# Altium schematic sheet Sheet1.SchDoc
size A3; SheetNumber: 1; SheetTotal: 1
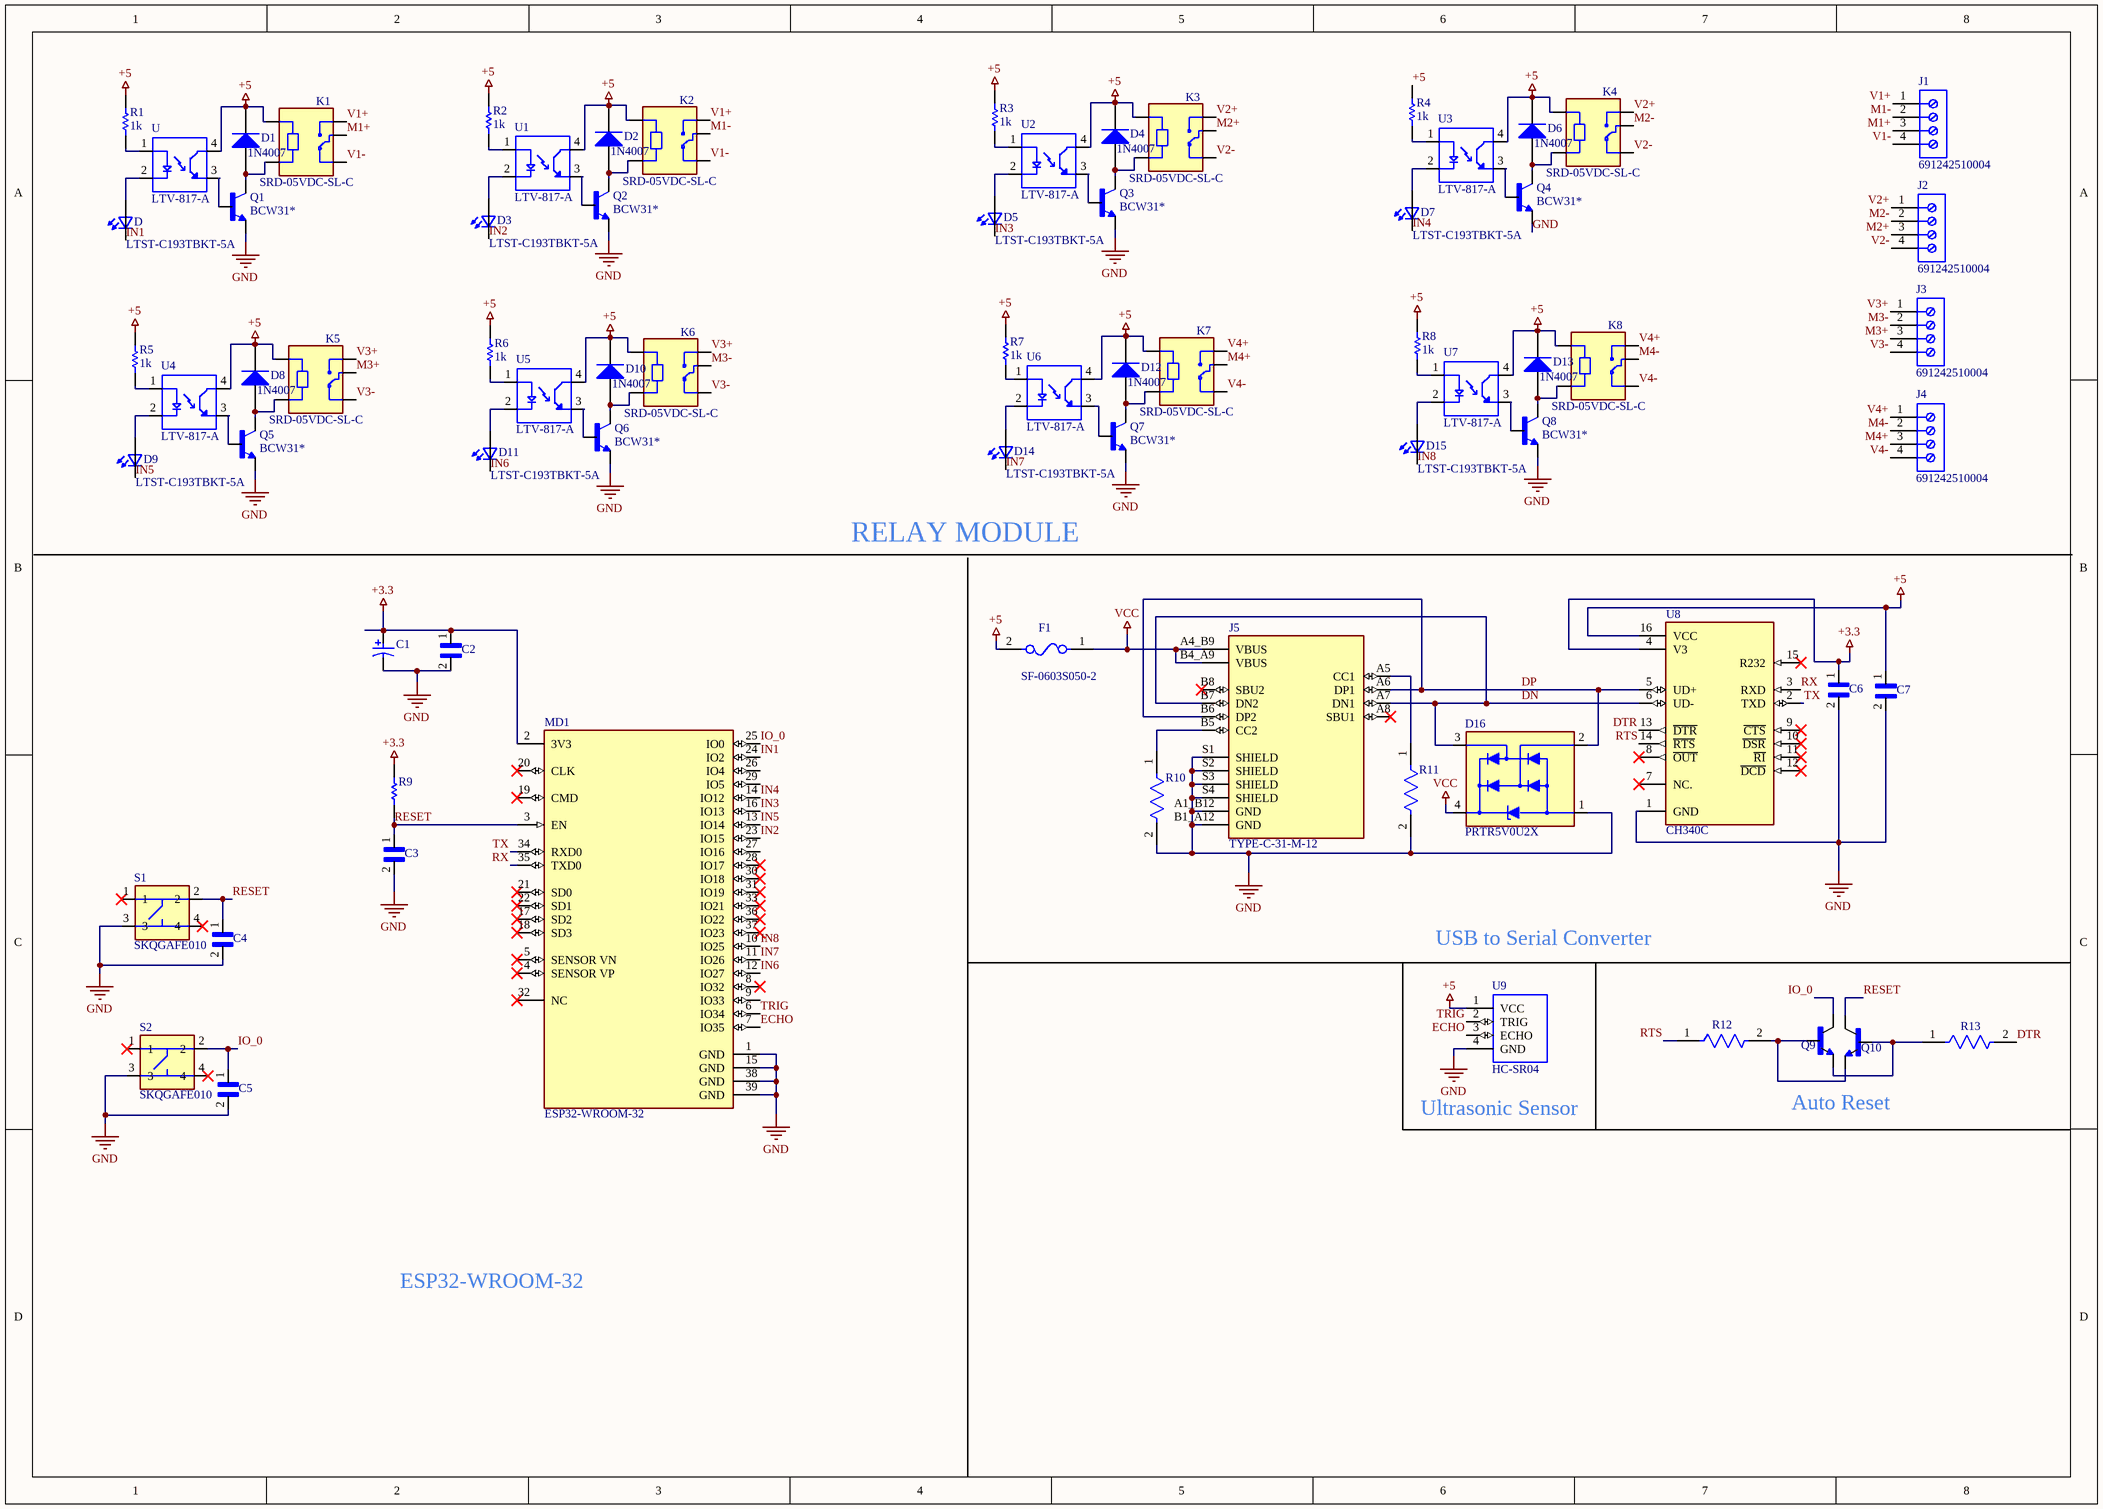
[diagram p0: Sheet1.SchDoc]

## Parts
C1  T491B226K010AT  [KEMT-T491-B_L]  (value not drawn)
C2  GRM31MR71H104KA01L  [CAPC3216X125N]  (value not drawn)
C3  GRM31MR71H104KA01L  [CAPC3216X125N]  (value not drawn)
C4  GRM31MR71H104KA01L  [CAPC3216X125N]  (value not drawn)
C5  GRM31MR71H104KA01L  [CAPC3216X125N]  (value not drawn)
C6  GRM31MR71H104KA01L  [CAPC3216X125N]  (value not drawn)
C7  GRM31MR71H104KA01L  [CAPC3216X125N]  (value not drawn)
D  LTST-C193TBKT-5A  [0603]
D1  1N4007  [FAIR-DO-41-2]
D2  1N4007  [FAIR-DO-41-2]
D3  LTST-C193TBKT-5A  [0603]
D4  1N4007  [FAIR-DO-41-2]
D5  LTST-C193TBKT-5A  [0603]
D6  1N4007  [FAIR-DO-41-2]
D7  LTST-C193TBKT-5A  [0603]
D8  1N4007  [FAIR-DO-41-2]
D9  LTST-C193TBKT-5A  [0603]
D10  1N4007  [FAIR-DO-41-2]
D11  LTST-C193TBKT-5A  [0603]
D12  1N4007  [FAIR-DO-41-2]
D13  1N4007  [FAIR-DO-41-2]
D14  LTST-C193TBKT-5A  [0603]
D15  LTST-C193TBKT-5A  [0603]
D16  PRTR5V0U2X  [SOT190P230X110-4N]
F1  SF-0603S050-2  [FP-SF-0603S-MFG]
J1  691242510004  [691242510004]
J2  691242510004  [691242510004]
J3  691242510004  [691242510004]
J4  691242510004  [691242510004]
J5  TYPE-C-31-M-12  [HRO_TYPE-C-31-M-12]
K1  SRD-05VDC-SL-C  [RELAY_SRD-05VDC-SL-C]
K2  SRD-05VDC-SL-C  [RELAY_SRD-05VDC-SL-C]
K3  SRD-05VDC-SL-C  [RELAY_SRD-05VDC-SL-C]
K4  SRD-05VDC-SL-C  [RELAY_SRD-05VDC-SL-C]
K5  SRD-05VDC-SL-C  [RELAY_SRD-05VDC-SL-C]
K6  SRD-05VDC-SL-C  [RELAY_SRD-05VDC-SL-C]
K7  SRD-05VDC-SL-C  [RELAY_SRD-05VDC-SL-C]
K8  SRD-05VDC-SL-C  [RELAY_SRD-05VDC-SL-C]
MD1  ESP32-WROOM-32  [FP-ESP32-WROOM-32-MFG]
Q1  BCW31*  [SOT23-BEC]
Q2  BCW31*  [SOT23-BEC]
Q3  BCW31*  [SOT23-BEC]
Q4  BCW31*  [SOT23-BEC]
Q5  BCW31*  [SOT23-BEC]
Q6  BCW31*  [SOT23-BEC]
Q7  BCW31*  [SOT23-BEC]
Q8  BCW31*  [SOT23-BEC]
Q9  BC846BW_RF  [*TRANS_BC846BW RFG]  (value not drawn)
Q10  BC846BW_RF  [*TRANS_BC846BW RFG]  (value not drawn)
R1  value 1k  [RESC3116X70X50ML13T20]  (hidden comment: Resistor 1k +/-1% 1206 250 mW)
R2  value 1k  [RESC3116X70X50ML13T20]  (hidden comment: Resistor 1k +/-1% 1206 250 mW)
R3  value 1k  [RESC3116X70X50ML13T20]  (hidden comment: Resistor 1k +/-1% 1206 250 mW)
R4  value 1k  [RESC3116X70X50ML13T20]  (hidden comment: Resistor 1k +/-1% 1206 250 mW)
R5  value 1k  [RESC3116X70X50ML13T20]  (hidden comment: Resistor 1k +/-1% 1206 250 mW)
R6  value 1k  [RESC3116X70X50ML13T20]  (hidden comment: Resistor 1k +/-1% 1206 250 mW)
R7  value 1k  [RESC3116X70X50ML13T20]  (hidden comment: Resistor 1k +/-1% 1206 250 mW)
R8  value 1k  [RESC3116X70X50ML13T20]  (hidden comment: Resistor 1k +/-1% 1206 250 mW)
R9  CRCW060310K0FKEA  [RESC1609X50X30NL8T20]  (value not drawn)
R10  CRCW06035K10FKEA  [FP-CRCW0603-e3-IPC_C]  (value not drawn)
R11  CRCW06035K10FKEA  [FP-CRCW0603-e3-IPC_C]  (value not drawn)
R12  RC0603FR-0710KL  [FP-RC0603-0_55-IPC_C]  (value not drawn)
R13  RC0603FR-0710KL  [FP-RC0603-0_55-IPC_C]  (value not drawn)
S1  SKQGAFE010  [SW_SKQGAFE010]
S2  SKQGAFE010  [SW_SKQGAFE010]
U  LTV-817-A  [DIP762W50P254L510H500Q4]
U1  LTV-817-A  [DIP762W50P254L510H500Q4]
U2  LTV-817-A  [DIP762W50P254L510H500Q4]
U3  LTV-817-A  [DIP762W50P254L510H500Q4]
U4  LTV-817-A  [DIP762W50P254L510H500Q4]
U5  LTV-817-A  [DIP762W50P254L510H500Q4]
U6  LTV-817-A  [DIP762W50P254L510H500Q4]
U7  LTV-817-A  [DIP762W50P254L510H500Q4]
U8  CH340C  [SOIC127P600X180-16N]
U9  HC-SR04  [XCVR_HC-SR04]

## Nets
+3.3: C1.1 C2.1 C6.1 MD1.2(3V3) R9.2 U8.4(V3)
+5: C7.1 D1.1(K) D2.1(K) D4.1(K) D6.1(K) D8.1(K) D10.1(K) D12.1(K) D13.1(K) F1.2 K1.A1 K2.A1 K3.A1 K4.A1 K5.A1 K6.A1 K7.A1 K8.A1 R1.2 R2.2 R3.2 R4.2 R5.2 R6.2 R7.2 R8.2 U.4(CT) U1.4(CT) U2.4(CT) U3.4(CT) U4.4(CT) U5.4(CT) U6.4(CT) U7.4(CT) U8.16(VCC) U9.1(VCC)
GND: C1.2 C2.2 C3.2 C4.2 C5.2 C6.2 C7.2 D16.1(GND) J5.A1_B12(GND) J5.B1_A12(GND) J5.S1(SHIELD) J5.S2(SHIELD) J5.S3(SHIELD) J5.S4(SHIELD) MD1.1(GND) MD1.15(GND) MD1.38(GND) MD1.39(GND) Q1.E Q2.E Q3.E Q4.E Q5.E Q6.E Q7.E Q8.E R10.2 R11.2 S1.3 S2.3 U8.1(GND) U9.4(GND)
VCC: D16.4(VCC) F1.1 J5.A4_B9(VBUS) J5.B4_A9(VBUS)
DN: D16.3(I/O_2) J5.A7(DN1) J5.B7(DN2) U8.6(UD-)
DP: D16.2(I/O_1) J5.A6(DP1) J5.B6(DP2) U8.5(UD+)
DTR: R13.2 U8.13(~{DTR})
ECHO: MD1.7(IO35) U9.3(ECHO)
IN1: D.1(K2) MD1.24(IO2)
IN2: D3.1(K2) MD1.23(IO15)
IN3: D5.1(K2) MD1.16(IO13)
IN4: D7.1(K2) MD1.14(IO12)
IN5: D9.1(K2) MD1.13(IO14)
IN6: D11.1(K2) MD1.12(IO27)
IN7: D14.1(K2) MD1.11(IO26)
IN8: D15.1(K2) MD1.10(IO25)
IO_0: C5.1 MD1.25(IO0) Q9.3(C) S2.2
M1+: J1.3 K1.COM
M1-: J1.2 K2.COM
M2+: J2.3 K3.COM
M2-: J2.2 K4.COM
M3+: J3.3 K5.COM
M3-: J3.2 K6.COM
M4+: J4.3 K7.COM
M4-: J4.2 K8.COM
RESET: C3.1 C4.1 MD1.3(EN) Q10.3(C) R9.1 S1.2
RTS: R12.1 U8.14(~{RTS})
RX: MD1.35(TXD0) U8.3(RXD)
TRIG: MD1.6(IO34) U9.2(TRIG)
TX: MD1.34(RXD0) U8.2(TXD)
V1+: J1.1 K1.NO K2.NO
V1-: J1.4 K1.NC K2.NC
V2+: J2.1 K3.NO K4.NO
V2-: J2.4 K3.NC K4.NC
V3+: J3.1 K5.NO K6.NO
V3-: J3.4 K5.NC K6.NC
V4+: J4.1 K7.NO K8.NO
V4-: J4.4 K7.NC K8.NC
NetD1_2: D1.2(A) K1.A2 Q1.C
NetD2_2: D2.2(A) K2.A2 Q2.C
NetD3_2: D3.2(A2) U1.2(C)
NetD4_2: D4.2(A) K3.A2 Q3.C
NetD5_2: D5.2(A2) U2.2(C)
NetD6_2: D6.2(A) K4.A2 Q4.C
NetD7_2: D7.2(A2) U3.2(C)
NetD8_2: D8.2(A) K5.A2 Q5.C
NetD9_2: D9.2(A2) U4.2(C)
NetD10_2: D10.2(A) K6.A2 Q6.C
NetD11_2: D11.2(A2) U5.2(C)
NetD12_2: D12.2(A) K7.A2 Q7.C
NetD13_2: D13.2(A) K8.A2 Q8.C
NetD14_2: D14.2(A2) U6.2(C)
NetD15_2: D15.2(A2) U7.2(C)
NetD_2: D.2(A2) U.2(C)
NetJ5_A5: J5.A5(CC1) R11.1
NetJ5_B5: J5.B5(CC2) R10.1
NetQ1_B: Q1.B U.3(ET)
NetQ2_B: Q2.B U1.3(ET)
NetQ3_B: Q3.B U2.3(ET)
NetQ4_B: Q4.B U3.3(ET)
NetQ5_B: Q5.B U4.3(ET)
NetQ6_B: Q6.B U5.3(ET)
NetQ7_B: Q7.B U6.3(ET)
NetQ8_B: Q8.B U7.3(ET)
NetQ9_1: Q9.1(B) Q10.2(E) R12.2
NetQ9_2: Q9.2(E) Q10.1(B) R13.1
NetR1_1: R1.1 U.1(A)
NetR2_1: R2.1 U1.1(A)
NetR3_1: R3.1 U2.1(A)
NetR4_1: R4.1 U3.1(A)
NetR5_1: R5.1 U4.1(A)
NetR6_1: R6.1 U5.1(A)
NetR7_1: R7.1 U6.1(A)
NetR8_1: R8.1 U7.1(A)

Not connected (* = marked no-connect by the designer): J5 A8(SBU1)* B8(SBU2)*; MD1 4(SENSOR_VP)* 5(SENSOR_VN)* 8(IO32)* 9(IO33) 17(SD2)* 18(SD3)* 19(CMD)* 20(CLK)* 21(SD0)* 22(SD1)* 26(IO4) 27(IO16) 28(IO17)* 29(IO5) 30(IO18)* 31(IO19)* 32(NC)* 33(IO21)* 36(IO22)* 37(IO23)*; S1 1* 4*; S2 1* 4*; U8 7(NC.)* 8(~{OUT})* 9(~{CTS})* 10(~{DSR})* 11(~{RI})* 12(~{DCD})* 15(R232)*

## Notes on the sheet
- RELAY MODULE
- USB to Serial Converter
- (near U9) Ultrasonic Sensor
- Auto Reset
- ESP32-WROOM-32

## Library data of the parts
C1 = CMP-2000-07193-1: Tantalum Capacitor, 22 uF, +/- 10%, 10 V, -55 to 125 degC, 2-Pin SMD, RoHS, Tape and Reel; Manufacturer: Kemet; Lead Spacing (nom): NotRequiredmm; Polarity: Polar; Insulation: NotRequired; Voltage: 10VDC; DCL: 2.2uA; ESR: 2.4ohm; Rad Hardened: No; Capacitance: 22000000pF; Product Length (mm): 3.5mm; Case Style: Molded; Product Depth (mm): 2.8mm; DF: 6%; Product Height (mm): 1.9mm; Seated Plane Height: NotRequiredmm; Failure Rate: NotRequired; Datasheet URL: http://capacitoredge.kemet.com/capedge2/DataSheet/Datasheet-T491B226K010AT.pdf?pn=T491B226K010AT; Mounting Technology: SurfaceMount; Datasheet Version: 10/2016; Construction: SMTChip; Package Reference: T491-B; Product Diameter (mm): NotRequiredmm; Operating Temp Range: -55Cto125C; Manufacturer URL: http://www.kemet.com/; Wire Form: NotRequired; Tolerance (+ or -): 10%; Case Code: B; Packaging: TapeandReel; Length W/Weld: NotRequiredmm; Package Description: 2-Pin Surface Mount Device, Body 3.5 x 2.8 mm; Length W/Weld (max): NotRequiredmm; Seal: NotRequired; Mounting Style: SurfaceMount; Package / Case: 3528-21
C2-C7 = GRM31MR71H104KA01L: CAP CER 0.1UF 50V X7R 1206; Package: None; Price: None; Value: *; MP: GRM31MR71H104KA01L; Availability: Unavailable
D D3 D5 D7 D9 D11 D14 D15 = LTST-C193TBKT-5A: Blue 470nm LED Indication - Discrete 2.8V 0603 _1608 Metric_; MF: Lite-On Inc.; MP: LTST-C193TBKT-5A; Value: *; Digi-Key_Purchase_URL: https://www.digikey.com/product-detail/en/lite-on-inc/LTST-C193TBKT-5A/160-1827-1-ND/2355044?utm_source=snapeda&utm_medium=aggregator&utm_campaign=symbol; SnapEDA_Link: https://www.snapeda.com/parts/LTST-C193TBKT-5A/Lite-On%20Inc./view-part/350303/?ref=snap; Digi-Key_Part_Number: 160-1827-1-ND; Package: 0603 Lite-On
D1 D2 D4 D6 D8 D10 D12 D13 = CMP-004-00007-2: General Purpose Rectifier, 1.1 V, 1.0 A, -55 to 175 degC, 2-Pin DO-41, RoHS, Tape and Reel; Manufacturer: Fairchild; Peak Reverse Current: 5uA; Max Surge Current: 30A; Elements: 1; Forward Voltage: 1.1V; Package Version: Rev. 2, 09/2008; Forward Current: 1A; Package Quantity: 5000; Packaging: TapeandReel; Package URL: http://www.fairchildsemi.com/dwg/DO/DO41A.pdf; Manufacturer URL: https://www.fairchildsemi.com/; Package Reference: DO-41-2; Pins: 2; Min Operating Temperature: -55°C; Datasheet Version: Rev. 1.1.0, 11/2014; Max Operating Temperature: 175°C; RoHS Compliant: True; Case/Package: DO-41-2; Mounting Technology: TH; Package Description: 2-Pin Axial Lead, Dia 2.375 mm, Body Length 4.63 mm; Datasheet URL: https://www.fairchildsemi.com/datasheets/1N/1N4007.pdf
D16 = PRTR5V0U2X: Nexperia PRTR5V0U2X,215, Dual-Element Uni-Directional TVS Diode, 4-Pin SOT-143B; MF: NXP Semiconductors; Check_prices: https://www.snapeda.com/parts/PRTR5V0U2X/NXP+Semiconductors/view-part/?ref=eda; Value: *; Purchase-URL: https://pricing.snapeda.com/search/part/PRTR5V0U2X/?ref=eda; Price: None; MP: PRTR5V0U2X; SnapEDA_Link: https://www.snapeda.com/parts/PRTR5V0U2X/NXP+Semiconductors/view-part/?ref=snap; Availability: In Stock; Package: TO-253-4 Nexperia USA Inc.
F1 = CMP-07399-000004-1: FUSE BOARD MNT 500MA 50VDC 0603; Manufacturer: Bourns Inc.; Fuse I2T: 0.009A2Sec; Fuse Current: 0.5A; Fuse Interrupt Ac Current: 50A; Max Fuse Ac Voltage: 35V; Resistance: 232mΩ; Fuse Blow Speed: Slow; Value: 232mΩ; Max Fuse Dc Voltage: 50V; Automotive: No; Category: Fuse; Temperature Range High: +105°C; Device Class L1: Circuit Protection; Height: 0.55mm; RoHS: TRUE; ComponentLink2URL: https://www.bourns.com/docs/product-datasheets/sf0603s.pdf; Ipc Land Pattern Name: CAPC16080X45; Temperature Range Low: -20°C; Mouser Description: Surface Mount Fuses 0.50A Slow Blow SinglFuse; Manufacturer Part Number: SF-0603S050-2; Package: SF-0603S; Device Class L3: unset; Digikey Description: FUSE BOARD MNT 500MA 50VDC 0603; Device Class L2: Fuses; Lead Free: Yes; Temperature: -20°C to +105°C; ComponentLink2Description: Datasheet; Octopart: https://octopart.com/sf-0603s050-2-bourns-10486821; Fuse Interrupt Dc Current: 50A
J1-J4 = CMP-1502-02636-2: NexarPartId: 105996315
J5 = TYPE-C-31-M-12: USB Connectors 24 Receptacle 1 8.94*7.3mm RoHS; MF: HRO Electronics Co., Ltd.; Price: None; Value: *; SnapEDA_Link: https://www.snapeda.com/parts/TYPE-C-31-M-12/HRO+Electronics+Co.%252C+Ltd./view-part/?ref=snap; Package: Package; Availability: Not in stock; Check_prices: https://www.snapeda.com/parts/TYPE-C-31-M-12/HRO+Electronics+Co.%252C+Ltd./view-part/?ref=eda; MP: TYPE-C-31-M-12
K1-K8 = SRD-05VDC-SL-C: 5V Trigger Relay Module For Arduino And Raspberry Pi 5V Trigger Relay Module For Arduino And Raspberry Pi; MF: Songle Relay; Check_prices: https://www.snapeda.com/parts/SRD-05VDC-SL-C/Songle+Relay/view-part/?ref=eda; Value: *; Availability: Not in stock; Price: None; Package: NON STANDARD-5 Songle Relay; MP: SRD-05VDC-SL-C; SnapEDA_Link: https://www.snapeda.com/parts/SRD-05VDC-SL-C/Songle+Relay/view-part/?ref=snap
MD1 = CMP-194065-000008-1: RX TXRX MOD WIFI SURFACE MOUNT; Frequency: 2.5GHz; Sensitivity: -98dBm; Operating Supply Voltage: 3.6V; Data Rate: 150Mbps; Weight: 0.088185oz; Package Quantity: 550; Min Operating Temperature: -40°C; Mount: Surface Mount; Max Operating Temperature: 85°C; Packaging: Cut Tape; Case/Package: SMD/SMT
Q1-Q8 = BCW31*: Bipolar (BJT) Transistor NPN General Purpose Amplifier Surface Mount; MF: ON Semiconductor; MP: BCW31; SnapEDA_Link: https://www.snapeda.com/parts/BCW31/Onsemi/view-part/?ref=snap; Package: SOT-23 ON Semiconductor; Value: *; Check_prices: https://www.snapeda.com/parts/BCW31/Onsemi/view-part/?ref=eda
R1-R8 = CMP-009-00011-5: Chip Resistor, 1 KOhm, +/- 1%, 0.25 W, -55 to 155 degC, 1206 (3216 Metric); Voltage Rating: 200V; Power: 250mW; Max Operating Temperature: 155°C; Mounting Technology: SM; Tolerance: 1%; Case/Package: 1206; RoHS Compliant: True; Min Operating Temperature: -55°C; Pins: 2
R9 = CMP-1666-00005-4: Chip Resistor, 10 KOhm, +/- 1%, 100 mW, -55 to 155 degC, 0603 (1608 Metric), RoHS, Tape and Reel; Manufacturer: Vishay Semiconductor; Voltage Rating: 75 V; Max Operating Temperature: 155 degC; PackageDescription: 2-Pin Surface Mount Device, Body 1.575 x 0.85 mm; ComponentLink1Description: Manufacturer URL; RoHSCompliant: true; PackageReference: 0603; REACH SVHC: Unknown; Length: 1.55 mm; DatasheetVersion: 06/2012; Packaging: Tape and Reel; Min Operating Temperature: -55 degC; Mounting Technology: Surface Mount; ComponentLink2URL: https://datasheet.ciiva.com/11809/0900766b80d98afc-11809037.pdf; Height: 0.45 mm; ComponentLink2Description: Datasheet; Package Quantity: 5000; ComponentLink1URL: http://www.vishay.com/
R10 R11 = CMP-1012-00590-3: RES Thick Film, 5.1kΩ, 1%, 0.1W, 100ppm/°C, 0603; Power Rating: 100mW; Voltage Rating (DC): 75V; Resistance: 5.1kR; Width: 0.85mm; Depth: 0.85mm; Military Standard: Not; Package Quantity: 5000; Case Code (Metric): 1608; Length: 1.55mm; Weight: 7.1E-05oz; Packaging: Tape and Reel; Temperature Coefficient: 100ppm/°C; Case Code (Imperial): 0603; Lead Free: Lead Free; Radiation Hardening: No; Contact Plating: Tin; Composition: Thick Film; Max Operating Temperature: 155°C; Termination: SMD/SMT; Case/Package: 0603; Min Operating Temperature: -55°C; Tolerance: 1%; Voltage Rating: 75V; Mount: Surface Mount; Height: 0.45mm
R12 R13 = CMP-2100-03664-2: RES 10K OHM 1% 1/10W 0603; Voltage Rating: 75V; Voltage Rating (DC): 50V; Resistance: 10kR; Power Rating: 100mW; Temperature Coefficient: 100ppm/°C; Depth: 0.8mm; Termination: SMD/SMT; Resistor Type: Thick Film; Series: RC; Construction: Rectangular; Features: Moisture Resistant; Packaging: Tape and Reel; Min Operating Temperature: -55°C; Number of Terminations: 2; Lead Pitch: 0.3mm; RoHS Compliant: Yes; Case/Package: 0603; Resistance Tolerance: 1%; Military Standard: Not; Weight: 7.1E-05oz; Number of Pins: 2; Tolerance: 1%; Length: 1.6mm; Case Code (Imperial): 0603; Lead Free: Lead Free; Width: 0.8mm; Max Power Dissipation: 100mW; Height: 0.45mm; Max Operating Temperature: 155°C; Case Code (Metric): 1608; Size Code: 0603
S1 S2 = SKQGAFE010: Switch Tactile N.O. SPST Button Gull Wing 0.05A 12VDC 0.98N SMD T/R; MF: ALPS; Price: None; Availability: In Stock; Package: None; MP: SKQGAFE010; Value: *; Purchase-URL: https://pricing.snapeda.com/search/part/SKQGAFE010/?ref=eda
U U1-U7 = LTV-817-A: Optoisolator Transistor Output 5000Vrms 1 Channel 4-DIP; MF: Lite-On Inc.; MP: LTV-817-A; Package: DIP-4 Lite-On Inc.; Digi-Key_Part_Number: 160-2037-5-ND; SnapEDA_Link: https://www.snapeda.com/parts/LTV-817-A/Lite-On%20Inc./view-part/3215369/?ref=snap; Value: *; Digi-Key_Purchase_URL: https://www.digikey.bg/product-detail/en/lite-on-inc/LTV-817-A/160-2037-5-ND/3199509?utm_source=snapeda&utm_medium=aggregator&utm_campaign=symbol
U8 = CH340C: USB to serial chip CH340; MF: WCH; Price: None; Availability: Not in stock; MP: CH340C; Package: None; SnapEDA_Link: https://www.snapeda.com/parts/CH340C/WCH/view-part/?ref=snap; Check_prices: https://www.snapeda.com/parts/CH340C/WCH/view-part/?ref=eda; Value: *
U9 = HC-SR04: Ultrasonic Sensor Module; Availability: Unavailable; MP: HC-SR04; Value: *; Price: None; Package: None
Q9 Q10 = BC846BW_RF: SnapEDA_Link: https://www.snapeda.com/parts/BC846BW%20RFG/Taiwan+Semiconductor/view-part/?ref=snap; Check_prices: https://www.snapeda.com/parts/BC846BW%20RFG/Taiwan+Semiconductor/view-part/?ref=eda; Value: *